# EAGLE design rev1 (EAGLE 6.2)
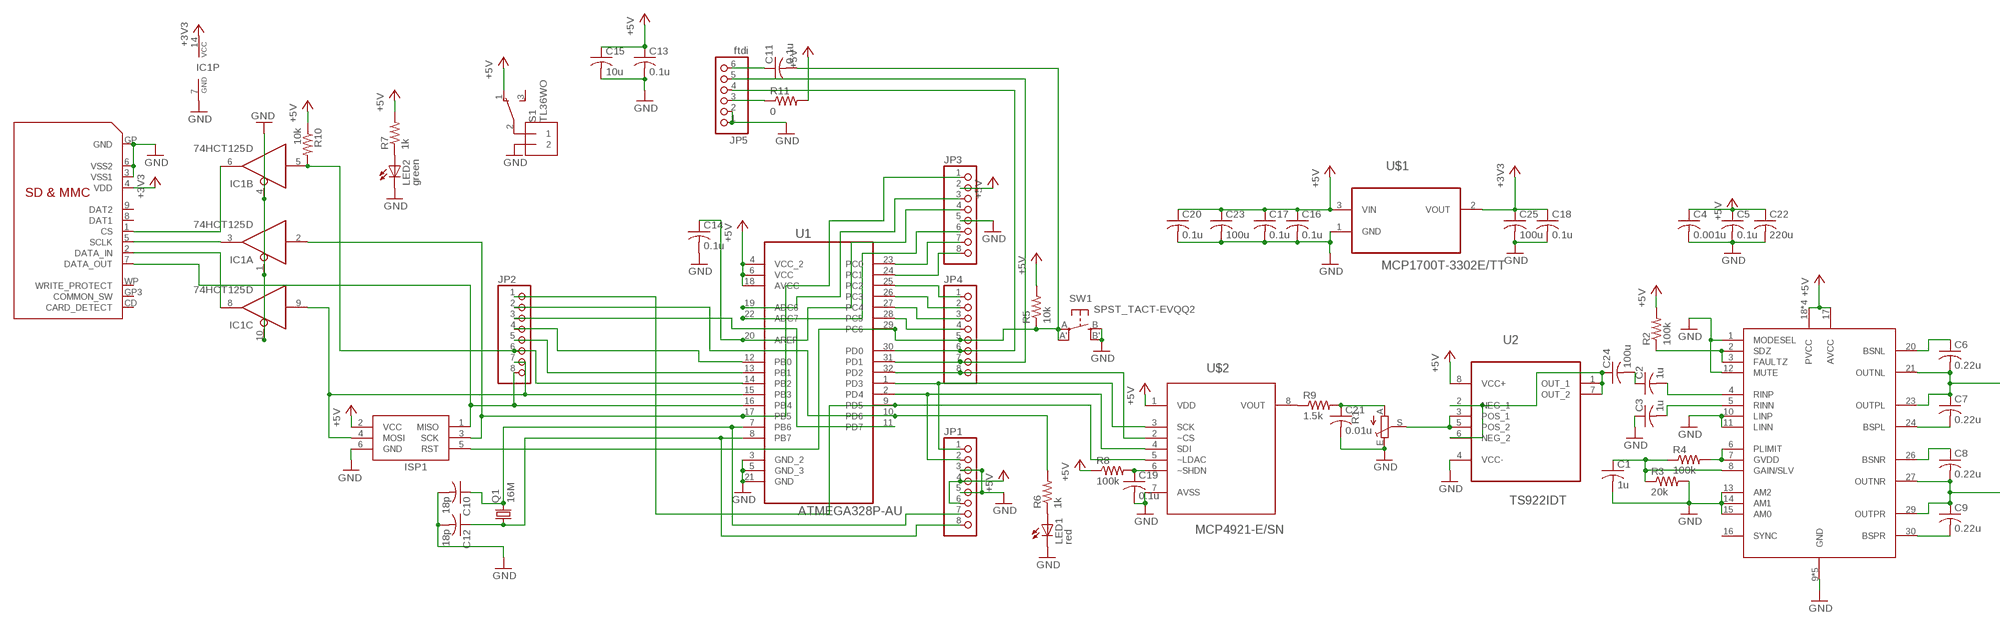
[diagram p0: schematic, sheet 1, part 1 of 2]
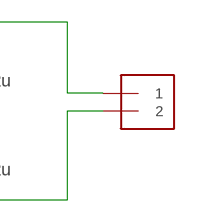
[diagram p1: schematic, sheet 1, part 2 of 2]

## Parts
C1  1u  C-USC0603  [C0603]
C2  1u  C-USC0603  [C0603]
C3  1u  C-USC0603  [C0603]
C4  0.001u  C-USC0603  [C0603]
C5  0.1u  C-USC0603  [C0603]
C6  0.22u  C-USC0603  [C0603]
C7  0.22u  C-USC0603  [C0603]
C8  0.22u  C-USC0603  [C0603]
C9  0.22u  C-USC0603  [C0603]
C10  18p  C-USC0603  [C0603]
C11  0.1u  C-USC0603  [C0603]
C12  18p  C-USC0603  [C0603]
C13  0.1u  C-USC0603  [C0603]
C14  0.1u  C-USC0603  [C0603]
C15  10u  C-US025-050X050  [C025-050X050]
C16  0.1u  C-USC0603  [C0603]
C17  0.1u  C-USC0603  [C0603]
C18  0.1u  C-USC0603  [C0603]
C19  0.1u  C-USC0603  [C0603]
C20  0.1u  C-USC0603  [C0603]
C21  0.01u  C-USC0603  [C0603]
C22  220u  C-US025-060X050  [C025-060X050]
C23  100u  C-US025-050X050  [C025-050X050]
C24  100u  C-US025-050X050  [C025-050X050]
C25  100u  C-US025-050X050  [C025-050X050]
IC1  74HCT125D  [SO14]
ISP1  AVRISP-6  [AVRISP]
J1  POWER  1X2-3.5MM  [1X2-3.5MM]
J2  Speaker  1X2-3.5MM  [1X2-3.5MM]
JP1  PINHD-1X8BIG  [1X08-BIG]
JP2  PINHD-1X8BIG  [1X08-BIG]
JP3  PINHD-1X8BIG  [1X08-BIG]
JP4  PINHD-1X8BIG  [1X08-BIG]
JP5  ftdi  PINHD-1X6  [1X06]
LED1  red  LED3MM  [LED3MM]
LED2  green  LED3MM  [LED3MM]
Q1  16M  CRYSTALHC49UP  [HC49UP]
R1  TRIM_EU-CA9V  [CA9V]
R2  100k  R-US_R0603  [R0603]
R3  20k  R-US_R0603  [R0603]
R4  100k  R-US_R0603  [R0603]
R5  10k  R-US_R0603  [R0603]
R6  1k  R-US_R0603  [R0603]
R7  1k  R-US_R0603  [R0603]
R8  100k  R-US_R0603  [R0603]
R9  1.5k  R-US_R0603  [R0603]
R10  10k  R-US_R0603  [R0603]
R11  0  R-US_R0603  [R0603]
S1  TL36WO  [TL3XWO]
SW1  SPST_TACT-EVQQ2  [EVQ-Q2]
U1  ATMEGA328P-AU  [QFP80P900X900X120-32N]
U2  TS922IDT  [SOIC127P600X175-8N]
U$1  MCP1700T-3302E/TT  [SOT95P237X112-3N]
U$2  MCP4921-E/SN  [SOIC8-N_MC]
U$3  SDMMC06132  [06132]
U$4  TPA3118D2DAP  [TPA3118D2DAP]

## Nets
+3V3: C18.1 C25.1 IC1.14(P:VCC) U$1.2(VOUT) U$3.4(VDD)
+5V: C4.1 C5.1 C13.1 C15.1 C16.1 C17.1 C20.1 C22.1 C23.1 ISP1.2(VCC) JP1.4 JP1.6 JP3.2 R2.2 R5.2 R7.2 R8.1 R10.1 R11.2 S1.1(O) U1.4(VCC_2) U1.6(VCC) U1.18(AVCC) U2.8(VCC+) U$1.3(VIN) U$2.1(VDD) U$4.17(AVCC) U$4.18(PVCC) U$4.19(PVCC) U$4.31(PVCC) U$4.32(PVCC)
GND: C1.2 C3.1 C4.2 C5.2 C10.2 C12.2 C13.2 C14.2 C15.2 C16.2 C17.2 C18.2 C19.2 C20.2 C21.2 C22.2 C23.2 C25.2 IC1.1(A:OE) IC1.4(B:OE) IC1.7(P:GND) IC1.10(C:OE) ISP1.6(GND) J1.2 JP1.3 JP1.5 JP3.5 JP5.1 JP5.2 LED1.K(C) LED2.K(C) R1.E R3.2 SW1.B'(S1) SW1.B(S) U1.3(GND_2) U1.5(GND_3) U1.21(GND) U2.4(VCC-) U$1.1(GND) U$2.7(AVSS) U$3.3(VSS1) U$3.6(VSS2) U$3.GP(GND) U$4.1(MODESEL) U$4.9(GND) U$4.10(LINP) U$4.11(LINN) U$4.12(MUTE) U$4.13(AM2) U$4.14(AM1) U$4.15(AM0) U$4.22(GND) U$4.25(GND) U$4.28(GND) U$4.33(GND)
N$1: C6.1 U$4.20(BSNL)
N$2: R2.1 U$4.2(SDZ) U$4.3(FAULTZ)
N$3: R4.2 U$4.6(PLIMIT) U$4.7(GVDD)
N$4: C1.1 R3.1 R4.1 U$4.8(GAIN/SLV)
N$5: C6.2 C7.1 J2.1 U$4.21(OUTNL) U$4.23(OUTPL)
N$6: C7.2 U$4.24(BSPL)
N$7: C8.1 U$4.26(BSNR)
N$8: C3.2 U$4.5(RINN)
N$9: C8.2 C9.1 J2.2 U$4.27(OUTNR) U$4.29(OUTPR)
N$10: C9.2 U$4.30(BSPR)
N$11: C2.2 U$4.4(RINP)
N$12: ISP1.1(MISO) JP2.8 U1.16(PB4) U$3.7(DATA_OUT)
N$13: C10.1 JP1.7 Q1.2 U1.7(PB6)
N$15: JP4.4 U1.28(PC5)
N$16: C11.1 JP5.6
N$17: JP5.3 R11.1
N$18: C12.1 JP1.8 Q1.1 U1.8(PB7)
N$19: LED1.A R6.1
N$20: C14.1 JP3.4 U1.20(AREF)
N$21: IC1.9(C:I) ISP1.4(MOSI) JP2.7 U1.15(PB3)
N$22: JP4.3 U1.27(PC4)
N$23: LED2.A R7.1
N$24: J1.1 S1.2(P)
N$25: JP4.7 JP5.5 U1.31(PD1)
N$26: JP4.6 JP5.4 U1.30(PD0)
N$27: C11.2 ISP1.5(RST) JP4.5 R5.1 SW1.A'(P1) SW1.A(P) U1.29(PC6)
N$28: JP4.2 U1.26(PC3)
N$29: JP4.1 U1.25(PC2)
N$30: JP4.8 U1.32(PD2) U$2.2(~CS)
N$31: JP3.8 U1.24(PC1)
N$32: JP3.7 U1.23(PC0)
N$33: JP3.6 U1.22(ADC7)
N$34: JP3.3 U1.19(ADC6)
N$35: C24.1 U2.1(OUT_1) U2.2(NEG_1) U2.6(NEG_2) U2.7(OUT_2)
N$36: IC1.5(B:I) JP2.6 R10.2 U1.14(PB2)
N$37: JP2.5 U1.13(PB1)
N$38: JP2.4 U1.12(PB0)
N$39: JP2.3 U1.11(PD7)
N$40: JP2.2 R6.2 U1.10(PD6)
N$41: JP2.1 U1.9(PD5) U$2.5(~LDAC)
N$42: R1.S U2.3(POS_1) U2.5(POS_2)
N$43: C21.1 R1.A R9.2
N$44: JP1.1 U1.1(PD3) U$2.3(SCK)
N$45: JP1.2 U1.2(PD4) U$2.4(SDI)
N$46: C2.1 C24.2
N$47: IC1.3(A:O) U$3.5(SCLK)
N$48: IC1.8(C:O) U$3.2(DATA_IN)
N$49: IC1.6(B:O) U$3.1(CS)
N$52: IC1.2(A:I) ISP1.3(SCK) JP3.1 U1.17(PB5)
N$54: C19.1 R8.2 U$2.6(~SHDN)
N$55: R9.1 U$2.8(VOUT)
Unconnected: IC1.11(D:O) IC1.12(D:I) IC1.13(D:OE) S1.3(S) U$3.8(DAT1) U$3.9(DAT2) U$3.CD(CARD_DETECT) U$3.GP3(COMMON_SW) U$3.WP(WRITE_PROTECT) U$4.16(SYNC)

## Library data of the parts
C1-C25 = resistor:C-US: CAPACITOR, American symbol
IC1 = 74xx-eu:74*125: Quad bus BUFFER, 3-state
ISP1 = adafruit:AVRISP: AVR ISP HEADER Standard 6 pin header for AVR programming
J1 J2 = adafruit:1X2: 3.5mm Terminal block http://www.ladyada.net/library/pcb/eaglelibrary.html
JP1-JP4 = adafruit:PINHD-1X8: PIN HEADER
JP5 = adafruit:PINHD-1X6: PIN HEADER
LED1 LED2 = adafruit:LED: LED OSRAM: - CHIPLED LG R971, LG N971, LY N971, LG Q971, LY Q971, LO R971, LY R971 LH N974, LH R974 LS Q976, LO Q976, LY Q976 LO Q996 - Hyper CHIPLED LW Q18S LB Q993, LB Q99A, LB R99A - SideLED LS A670, LO A670, LY A670, LG A670, LP A670 LB A673, LV A673, LT A673, LW A673 LH A674 LY A675 LS A676, LA A676, LO A676, LY A676, LW A676 LS A679, LY A679, LG A679 - Hyper Micro SIDELED® LS Y876, LA Y876, LO Y876, LY Y876 LT Y87S - SmartLED LW L88C, LW L88S LB L89C, LB L89S, LG L890 LS L89K, LO L89K, LY L89K LS L896, LA L896, LO L896, LY L896 - TOPLED LS T670, LO T670, LY T670, LG T670, LP T670 LSG T670, LSP T670, LSY T670, LOP T670, LYG T670 LG T671, LOG T671, LSG T671 LB T673, LV T673, LT T673, LW T673 LH T674 LS T676, LA T676, LO T676, LY T676, LB T676, LH T676, LSB T676, LW T676 LB T67C, LV T67C, LT T67C, LS T67K, LO T67K, LY T67K, LW E67C LS E67B, LA E67B, LO E67B, LY E67B, LB E67C, LV E67C, LT E67C LW T67C LS T679, LY T679, LG T679 LS T770, LO T770, LY T770, LG T770, LP T770 LB T773, LV T773, LT T773, LW T773 LH T774 LS E675, LA E675, LY E675, LS T675 LS T776, LA T776, LO T776, LY T776, LB T776 LHGB T686 LT T68C, LB T68C - Hyper Mini TOPLED® LB M676 - Mini TOPLED Santana® LG M470 LS M47K, LO M47K, LY M47K Source: http://www.osram.convergy.de/
Q1 = adafruit:CRYSTAL: CRYSTAL; OC_FARNELL: unknown; OC_NEWARK: unknown
R1 = pot:TRIM_EU-: POTENTIOMETER
R2-R11 = resistor:R-US_: RESISTOR, American symbol
S1 = switch:TL36WO: TINY SWITCH ON - ON Source: http://www2.produktinfo.conrad.com/datenblaetter/700000-724999/705152-da-01-de-Subminiaturschalter_TL_36WO.pdf
SW1 = adafruit:SPST_TACT: SMT 6mm switch, EVQQ2 series http://www.ladyada.net/library/eagle
U1 = Atmel_By_element14_Batch_1:ATMEGA328P-AU: 8-bit Microcontroller with In-System Programmable Flash; MPN: ATMEGA328P-AU; OC_FARNELL: 1715486; OC_NEWARK: 14R4631; PACKAGE: TQFP-32; SUPPLIER: Atmel
U2 = ST Microelctronics_By_element14_Batch_1:TS922IDT: operational amplifiers; MPN: TS922IDT; OC_FARNELL: 1642724; OC_NEWARK: 08P4888; PACKAGE: SOIC-8; SUPPLIER: STMICROELECTRONICS
U$1 = Microchip_By_element14_Batch_1:MCP1700T-3302E/TT: Low Quiescent Current LDO; MPN: MCP1700T-3302E/TT; OC_FARNELL: 1296592; OC_NEWARK: 88H9817; PACKAGE: SOT23-3; SUPPLIER: Microchip
U$2 = Microchip_By_element14_Batch_1:MCP4921-E/SN: 12 Bit DAC; DESCRIPTION: 12 Bit DAC; MPN: MCP4921-E/SN; OC_FARNELL: 1332113; OC_NEWARK: 08J8744; PACKAGE: SOIC-8; SUPPLIER: Microchip
U$3 = adafruit:SDMMC: SD MMC Card holder 4UCON part #06132 - easy to solder
U$4 = Texas Instruments_By_element14_Batch_1:TPA3118D2DAP

## Board
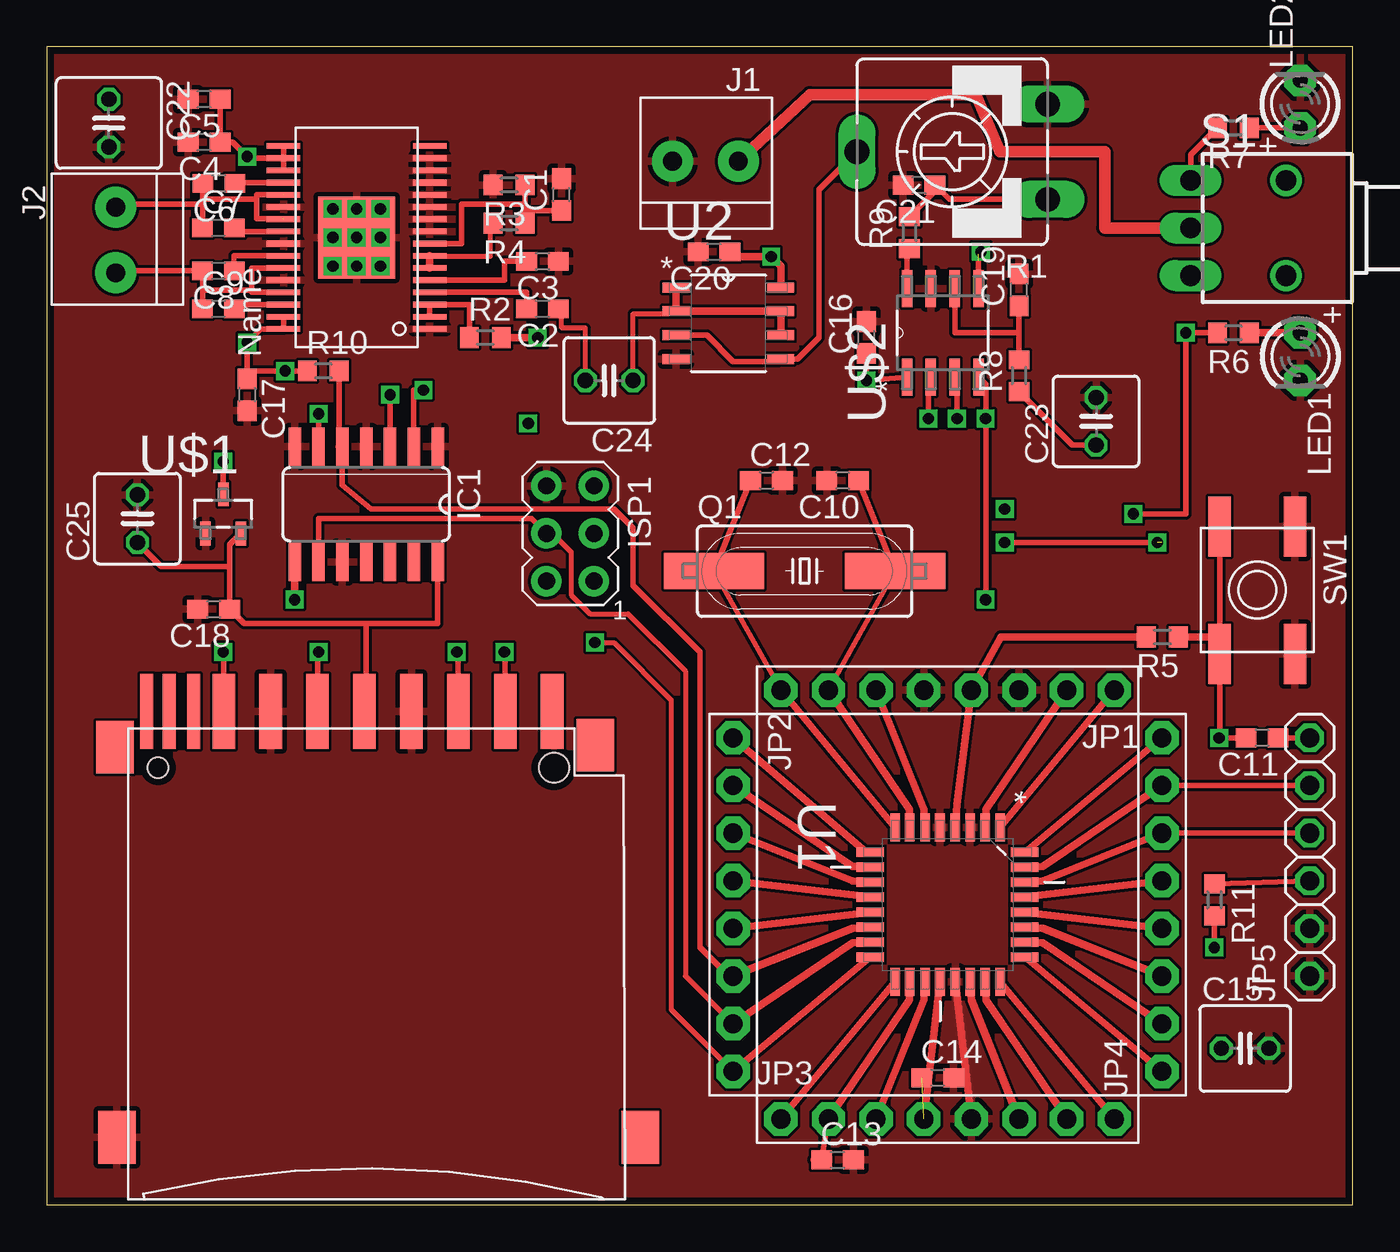
[diagram p2: board, top side]
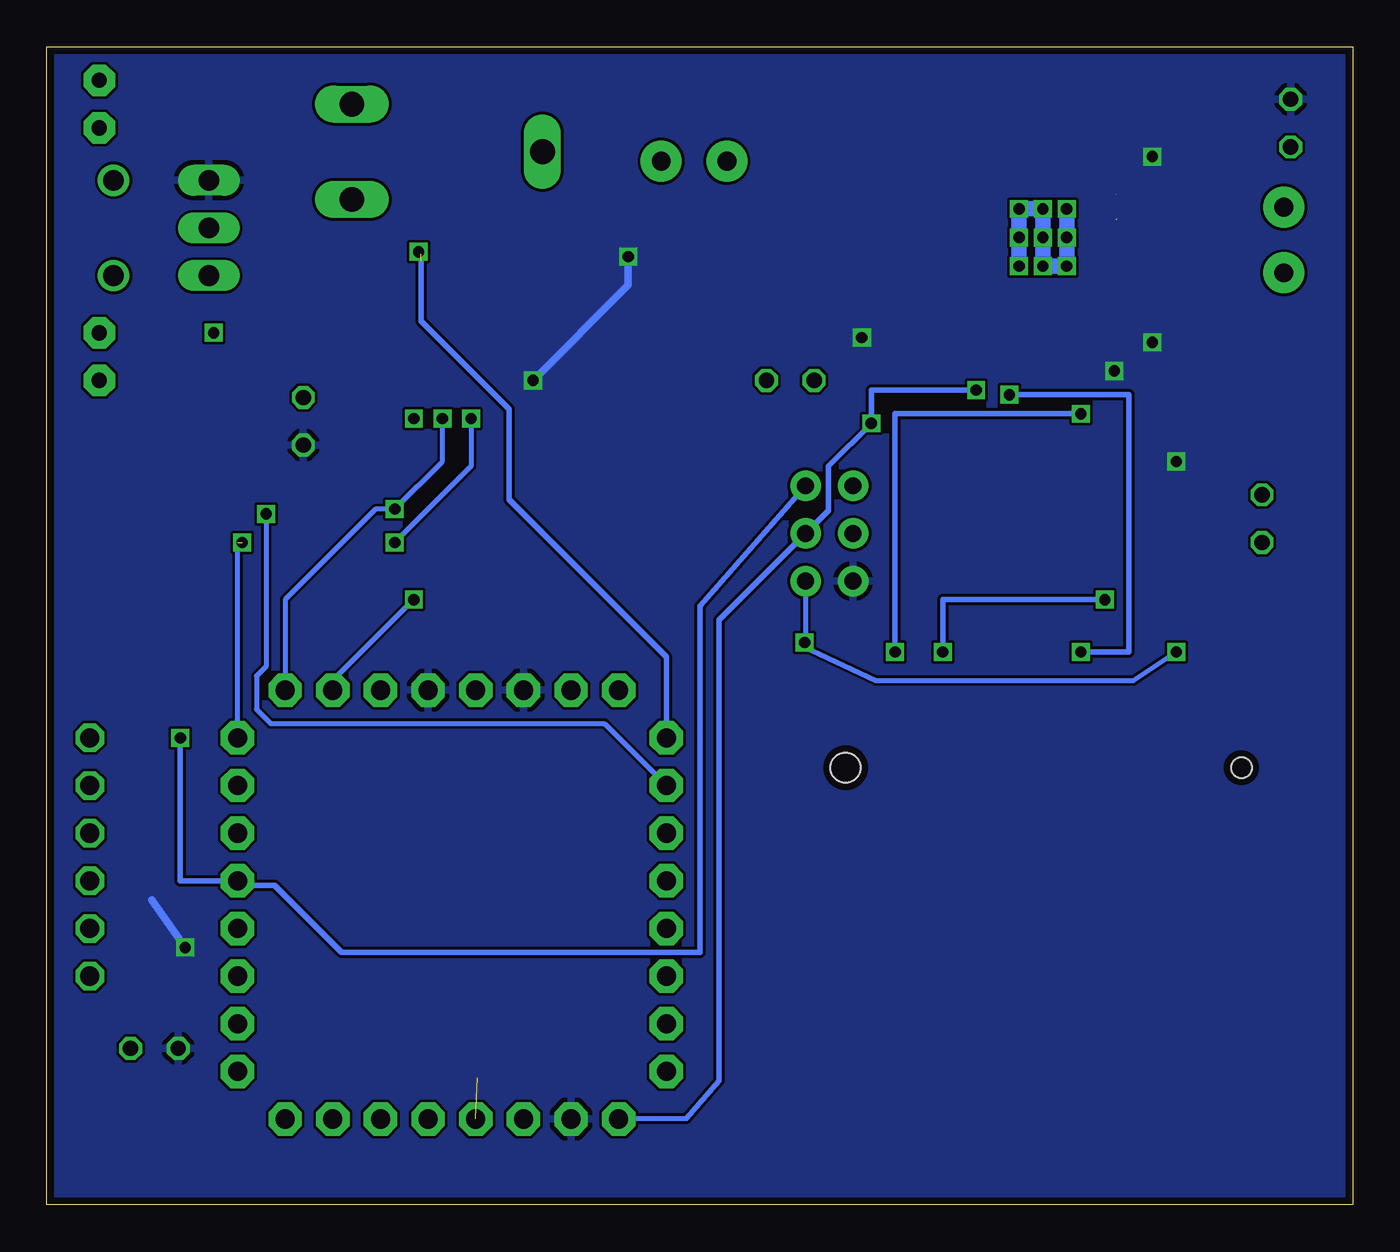
[diagram p3: board, bottom side, seen from below]

Size 69.6 x 61.72 mm. Coordinates in mm from the lower left corner, seen from the top.
Outline: 0,0 69.6,0 69.6,61.72 0,61.72 0,0
Copper layers (1*16): Top 0.0356mm / dielectric 1.5011mm / Bottom 0.0356mm
Design rules: minimum track width 6mil, minimum drill 13mil, track to track 6mil, track to pad 6mil, pad to pad 6mil, via to via 6mil, smd to smd 6mil, copper to edge 15mil, drill to drill 6mil, minimum pad ring 7mil, minimum via ring 7mil, stop-mask expansion 3mil, vias tented up to drill 0mil, thermal gap 10mil

### Footprints (pad centres in the part's own frame; a part is rotated, then mirrored left to right if it is on the bottom)
C0603 = smd 1.1 x 1: 1 -0.85,0; 2 0.85,0
C025-050X050 = drill 0.813 octagon: 1 -1.27,0; 2 1.27,0
C025-060X050 = drill 0.813 octagon: 1 -1.27,0; 2 1.27,0
SO14 = smd 0.66 x 2.032: 1 -3.81,-3.073; 2 -2.54,-3.073; 3 -1.27,-3.073; 4 0,-3.073; 5 1.27,-3.073; 6 2.54,-3.073; 7 3.81,-3.073; 8 3.81,3.073; 9 2.54,3.073; 10 1.27,3.073; 11 0,3.073; 12 -1.27,3.073; 13 -2.54,3.073; 14 -3.81,3.073
AVRISP = drill 0.9 pad 1.626: 1 -1.27,2.54; 2 1.27,2.54; 3 -1.27,0; 4 1.27,0; 5 -1.27,-2.54; 6 1.27,-2.54
1X2-3.5MM = drill 1 pad 2.184: 1 1.8,0; 2 -1.7,0
1X08-BIG = drill 1.016 pad 1.778 octagon: 1 -8.89,0; 2 -6.35,0; 3 -3.81,0; 4 -1.27,0; 5 1.27,0; 6 3.81,0; 7 6.35,0; 8 8.89,0
1X06 = drill 1.016 octagon: 1 -6.35,0; 2 -3.81,0; 3 -1.27,0; 4 1.27,0; 5 3.81,0; 6 6.35,0
LED3MM = drill 0.813 pad 1.676 octagon: A -1.27,0; K 1.27,0
HC49UP = smd 5.334 x 1.93: 1 -4.826,0; 2 4.826,0
CA9V = drill 1.321 long: A -2.54,-5.08; E 2.54,-5.08; S 0,5.08
R0603 = smd 1 x 1.1: 1 -0.85,0; 2 0.85,0
TL3XWO = drill 1.1 pad 1.422 long: 1 -2.54,-5.08; 2 0,-5.08; 3 2.54,-5.08 | drill 1.1 pad 1.676: M1 -2.54,0; M2 2.54,0
EVQ-Q2 = smd 3.2 x 1.2: A -3.4,-2; A' 3.4,-2; B -3.4,2; B' 3.4,2
QFP80P900X900X120-32N = smd 1.473 x 0.508: 1 -4.115,2.794; 2 -4.115,2.007; 3 -4.115,1.194; 4 -4.115,0.406; 5 -4.115,-0.406; 6 -4.115,-1.194; 7 -4.115,-2.007; 8 -4.115,-2.794; 17 4.115,-2.794; 18 4.115,-2.007; 19 4.115,-1.194; 20 4.115,-0.406; 21 4.115,0.406; 22 4.115,1.194; 23 4.115,2.007; 24 4.115,2.794 | smd 0.508 x 1.473: 9 -2.794,-4.115; 10 -2.007,-4.115; 11 -1.194,-4.115; 12 -0.406,-4.115; 13 0.406,-4.115; 14 1.194,-4.115; 15 2.007,-4.115; 16 2.794,-4.115; 25 2.794,4.115; 26 2.007,4.115; 27 1.194,4.115; 28 0.406,4.115; 29 -0.406,4.115; 30 -1.194,4.115; 31 -2.007,4.115; 32 -2.794,4.115
SOIC127P600X175-8N = smd 1.422 x 0.533: 1 -2.794,1.905; 2 -2.794,0.635; 3 -2.794,-0.635; 4 -2.794,-1.905; 5 2.794,-1.905; 6 2.794,-0.635; 7 2.794,0.635; 8 2.794,1.905
SOT95P237X112-3N = smd 0.559 x 1.27: 1 -0.94,-1.041; 2 0.94,-1.041; 3 0,1.041
SOIC8-N_MC = smd 1.981 x 0.559: 1 -2.362,1.905; 2 -2.362,0.635; 3 -2.362,-0.635; 4 -2.362,-1.905; 5 2.362,-1.905; 6 2.362,-0.635; 7 2.362,0.635; 8 2.362,1.905
06132 = smd 1.2 x 4: 1 6.9,0.9; 2 4.4,0.9; 3 1.9,0.9; 4 -0.6,0.9; 5 -3.1,0.9; 6 -5.6,0.9; 7 -8.1,0.9; 9 9.4,0.9 | smd 0.7 x 4: 8 -9.7,0.9; CD -11,0.9; WP -12.2,0.9 | smd 2 x 2.8: GP -13.8,-21.8; GP2 14.1,-21.8; GP3 11.7,-0.9; GP4 -13.9,-1 | hole 1.1: -11.6,-2.1 | hole 1.6: 9.5,-2.1
TPA3118D2DAP = smd 0.3 x 1.8: 1 -4.875,-3.9; 2 -4.225,-3.9; 3 -3.575,-3.9; 4 -2.925,-3.9; 5 -2.275,-3.9; 6 -1.625,-3.9; 7 -0.975,-3.9; 8 -0.325,-3.9; 9 0.325,-3.9; 10 0.975,-3.9; 11 1.625,-3.9; 12 2.275,-3.9; 13 2.925,-3.9; 14 3.575,-3.9; 15 4.225,-3.9; 16 4.875,-3.9; 17 4.875,3.9; 18 4.225,3.9; 19 3.575,3.9; 20 2.925,3.9; 21 2.275,3.9; 22 1.625,3.9; 23 0.975,3.9; 24 0.325,3.9; 25 -0.325,3.9; 26 -0.975,3.9; 27 -1.625,3.9; 28 -2.275,3.9; 29 -2.925,3.9; 30 -3.575,3.9; 31 -4.225,3.9; 32 -4.875,3.9 | smd 4.36 x 4.11: 33 0,0

### Placement (x,y rotation side)
C1  27.43,53.85 90 top
C2  26.42,47.75 180 top
C3  26.42,50.29 180 top
C4  8.38,56.64 180 top
C5  8.38,58.93 180 top
C6  9.16,54.44 180 top
C7  9.14,52.07 0 top
C8  9.14,49.78 180 top
C9  9.14,47.75 0 top
C10  42.42,38.61 180 top
C11  64.77,24.89 180 top
C12  38.35,38.61 0 top
C13  42.14,2.39 0 top
C14  47.48,6.78 0 top
C15  63.87,8.34 0 top
C16  43.69,46.23 90 top
C17  10.67,43.18 270 top
C18  8.89,31.75 180 top
C19  51.82,48.77 90 top
C20  35.56,50.8 180 top
C21  46.48,54.36 180 top
C22  3.3,57.66 270 top
C23  55.93,41.76 90 top
C24  29.97,43.94 180 top
C25  4.83,36.58 90 top
IC1  17.02,37.34 180 top
ISP1  27.89,35.78 180 top
J1  35.05,55.63 0 top
J2  3.66,51.38 90 top
JP1  48.01,27.43 180 top
JP2  36.58,16 270 top
JP3  48.01,4.57 0 top
JP4  59.44,16 90 top
JP5  67.31,18.54 90 top
LED1  66.8,45.21 270 top
LED2  66.8,58.67 90 top
Q1  40.39,33.78 0 top
R1  48.26,56.13 90 top
R2  23.37,46.23 0 top
R3  24.64,54.36 180 top
R4  24.64,52.32 180 top
R5  59.46,30.27 180 top
R6  63.25,46.48 180 top
R7  63.25,57.4 180 top
R8  51.82,44.2 90 top
R9  45.97,51.82 90 top
R10  14.73,44.45 0 top
R11  62.23,16.26 270 top
S1  66.04,52.07 270 top
SW1  64.52,32.77 270 top
U1  48.01,16 270 top
U2  36.32,46.99 0 top
U$1  9.4,36.83 0 top
U$2  47.75,46.48 90 top
U$3  17.53,25.4 0 top
U$4  16.51,51.56 90 top

### Tracks (layer width: path | path; a pad name or v marks a point on that pad's centre or on a via)
+3V3
  Top 0.305: 17.02,27.57 17.02,30.99 | 17.02,30.99 20.83,30.99 IC1.14 | 17.02,30.99 10.5,30.99 C18.1 9.74,34.04 | 9.74,34.04 9.74,35.19 U$1.2 | C25.1 6.1,34.04 9.74,34.04
  Top 0.406: U$3.4 17.02,27.57
+5V  (via drill 0.6)
  Top 0.305: 10.67,44.45 v12.7,44.45 R10.1 | v9.4,39.62 U$1.3 | U$2.1 v43.69,43.94 C16.1 | R11.2 v62.23,13.72 | C17.1 v10.67,45.97 11.38,46.69 U$4.32 U$4.31 | S1.1 60.96,55.97 R7.2 | R8.1 54.67,40.49 C23.1 | JP3.2 C13.1 | U$4.18 U$4.19 | U$4.17 U$4.18 | U$4.18 10.76,55.79 v10.67,55.88 9.91,56.64 C4.1 C5.1
  Top 0.406: C17.1 10.67,44.45 | 40.89,2.39 C13.1 | U1.18 45.97,10.92 JP3.2 | U1.6 46.74,21.08 JP1.6 | v26.16,46.23 R2.2 | U2.8 39.12,50.04 v38.61,50.55 36.66,50.55 C20.1 | R5.2 50.84,30.27 JP1.4 48.51,21.34 U1.4
  Bottom 0.254: v10.67,55.88 10.41,55.88
  Bottom 0.406: v62.23,13.72 64.01,16.26 | v38.61,50.55 38.61,49.02 v43.69,43.94
  pour Bottom: 0.25,61.47 69.34,61.47 69.34,0.25 0.25,0.25
GND  (via drill 0.6)
  Top 0.406: U1.21 JP3.5
  Bottom 0.813: v15.24,53.09 v15.24,51.56 v15.24,50.04 v16.51,50.04 U$4.33 v16.51,53.09 v17.78,53.09 v17.78,50.04
  other vias: 17.78,51.56 16.51,51.56
  pour Top: 69.34,61.47 69.34,0.25 0.25,0.25 0.25,61.47
N$1
  Top 0.305: U$4.20 10.01,54.49 C6.1
N$2
  Top 0.305: U$4.2 U$4.3 22.54,47.99 R2.1
N$3
  Top 0.254: R4.2 23.62,52.32 23.62,50.55 20.41,50.55
  Top 0.406: U$4.7 20.41,50.55 U$4.6
N$4
  Top 0.254: R4.1 25.49,53
  Top 0.305: 25.49,53.34 22.1,53.34 22.1,51.31 22.1,51.24 U$4.8 | 25.49,53.34 R3.1 | C1.1 25.49,53 25.49,53.34
N$5  (2 unrouted)
  Top 0.254: C6.2 8.29,54.42 | J2.1 3.83,53.34
  Top 0.305: 8.29,54.42 8.29,53.59 | 8.29,53.59 8.29,53.34 | 8.29,53.34 C7.1 | 3.83,53.34 8.29,53.34 | 12.57,52.58 11.18,52.58 11.18,53.59 | U$4.21 11.18,53.85 11.18,53.59 | 11.18,53.59 8.29,53.59
N$6
  Top 0.305: U$4.24 9.99,51.89 C7.2
N$7
  Top 0.254: C8.1 9.99,50.59
  Top 0.305: 9.99,50.59 U$4.26
N$8
  Top 0.305: C3.2 24.38,50.29 24.38,49.29 U$4.5
N$9
  Top 0.254: 3.66,49.78 J2.2 | 10.92,48.77 10.92,48.64
  Top 0.305: C8.2 3.66,49.78 | C9.1 C8.2 | C8.2 8.29,48.77 10.92,48.77 10.92,49.94 U$4.27 | U$4.29 10.92,48.64
N$10
  Top 0.305: U$4.30 9.99,47.99 C9.2
N$11
  Top 0.305: U$4.4 25.57,48.64 C2.2
N$12  (via drill 0.6)
  Top 0.254: v29.21,29.97 30.23,29.97 33.27,26.92 33.27,10.41 JP2.8
  Top 0.305: U$3.7 9.43,29.46
  Top 0.406: U1.16 JP2.8 | 9.43,29.46 v9.4,29.46
  Bottom 0.254: v9.4,29.46 11.68,27.94 25.4,27.94 29.26,29.77 29.16,30.02 | ISP1.1 29.16,30.02 | 29.16,30.02 v29.21,29.97
N$13
  Top 0.305: C10.1 Q1.2 JP1.7
  Top 0.406: U1.7 45.97,21.08 JP1.7
N$15
  Top 0.406: JP4.4 U1.28
N$16
  Top 0.305: JP5.6 C11.1
N$17
  Top 0.305: JP5.3 R11.1
N$18
  Top 0.305: C12.1 Q1.1 JP1.8
  Top 0.406: 45.21,20.07 U1.8 JP1.8
N$19
  Top 0.406: LED1.A R6.1
N$20  (1 unrouted)
  Top 0.406: U1.20 JP3.4
N$21
  Top 0.254: JP2.7 34.04,12.19 34.04,28.45 30.99,31.5 28.96,31.5 27.94,32.51 27.94,34.8 26.95,35.78 ISP1.4 25.83,36.58
  Top 0.305: IC1.9 14.48,36.58 25.83,36.58
  Top 0.406: U1.15 42.93,13.97 JP2.7
N$22
  Top 0.406: JP4.3 53.09,14.73 U1.27
N$23
  Top 0.305: LED2.A R7.1
N$24
  Top 0.61: J1.1 40.66,59.18 49.53,59.18 50.8,56.13 56.39,56.13 56.39,52.07 S1.2
N$25
  Top 0.305: JP5.5 JP4.7
  Top 0.406: U1.31 53.09,18.03 JP4.7
N$26
  Top 0.305: JP5.4 JP4.6
  Top 0.406: JP4.6 53.09,17.27 U1.30
N$27  (via drill 0.6)
  Top 0.305: C11.2 v62.48,24.89 62.52,24.89 SW1.A' SW1.A
  Top 0.406: JP4.5 U1.29 | SW1.A' 62.52,30.27 R5.1
  Bottom 0.305: v62.48,24.89 62.48,17.27 JP4.5 | 58.76,17.04 57.46,17.04 53.88,13.46 34.8,13.46 34.8,31.93 ISP1.5 | 58.93,17.21 59.38,17.21
  Bottom 0.406: 58.76,17.04 58.93,17.21 | 59.38,17.21 JP4.5
N$28
  Top 0.406: U1.26 53.09,13.97 JP4.2
N$29
  Top 0.406: JP4.1 U1.25
N$30  (via drill 0.6)  (1 unrouted)
  Top 0.254: 46.99,43.99 U$2.2
  Top 0.305: v46.99,41.91 46.99,43.99 | v51.05,35.31 v59.18,35.31
  Top 0.406: JP4.8 U1.32
  Bottom 0.254: v46.99,41.91 46.99,39.37 v51.05,35.31 | JP4.8 59.44,35.31
N$31
  Top 0.406: U1.24 JP3.8
N$32
  Top 0.406: U1.23 50.04,10.92 JP3.7
N$33
  Top 0.406: JP3.6 49.28,10.92 U1.22
N$34
  Top 0.406: U1.19 46.74,10.92 JP3.3
N$35
  Top 0.254: C24.1 31.24,47.5 33.4,47.5 U2.2
  Top 0.406: U2.6 U2.7 U2.2 U2.1
N$36
  Top 0.254: JP2.6 36.32,12.19
  Top 0.305: 15.58,40.41 R10.2 | IC1.5 15.75,38.35 17.27,37.08 30.23,37.08 31.24,36.07 31.24,33.02 34.8,29.46 34.8,13.72 36.32,12.19
  Top 0.406: U1.14 42.93,14.73 JP2.6 | IC1.5 15.58,40.41
N$37
  Top 0.406: U1.13 JP2.5
N$38
  Top 0.406: U1.12 JP2.4
N$39
  Top 0.406: U1.11 42.93,17.27 JP2.3
N$40  (via drill 0.6)
  Top 0.305: R6.2 v60.71,46.48 60.71,36.83 v57.91,36.83
  Top 0.406: U1.10 43.94,18.03 42.93,18.03 JP2.2
  Bottom 0.254: v57.91,36.83 57.91,28.7 58.42,28.19 58.42,26.42 57.66,25.65 39.88,25.65 JP2.2
N$41  (via drill 0.6)  (1 unrouted)
  Top 0.305: U$2.5 49.66,50.67 v49.78,50.8
  Top 0.406: U1.9 43.69,18.8 JP2.1
  Bottom 0.305: JP2.1 36.58,29.21 44.96,37.59 44.96,42.42 49.66,47.12 49.66,50.29
N$42
  Top 0.254: 38.99,44.96 U2.5
  Top 0.305: U2.3 35.18,46.35 36.58,44.96 38.99,44.96 | U2.5 40,45.09 41.15,46.23 41.15,54.1 R1.S
N$43
  Top 0.305: R1.A 48.09,53.59 C21.1 47.33,54.02 R9.2
N$44  (via drill 0.6)
  Top 0.254: 48.51,43.99 U$2.3
  Top 0.305: v48.51,41.91 48.51,43.99
  Top 0.406: JP1.1 U1.1
  Bottom 0.254: v48.51,41.91 48.51,39.62 v51.05,37.08 52.07,37.08 56.9,32.26 JP1.1
N$45  (via drill 0.6)
  Top 0.254: 50.04,43.74 U$2.4
  Top 0.305: 50.04,43.74 v50.04,41.91 v50.04,32.26
  Top 0.406: U1.2 50.04,21.08 JP1.2
  Bottom 0.254: JP1.2 54.36,27.94 v50.04,32.26
N$46
  Top 0.254: C24.2 28.7,46.74 27.43,46.74 27.43,47.59 C2.1
N$47  (via drill 0.6)
  Top 0.305: U$3.5 14.43,29.46 | IC1.3 v18.29,43.18
  Top 0.406: 14.43,29.46 v14.48,29.46
  Bottom 0.305: v14.48,29.46 11.94,29.46 11.94,43.18 v18.29,43.18
N$48  (via drill 0.6)
  Top 0.305: U$3.2 21.93,29.46
  Top 0.406: 21.93,29.46 v21.84,29.46 | IC1.8 v13.21,32.26
  Bottom 0.305: v13.21,32.26 21.84,32.26 v21.84,29.46
N$49  (via drill 0.6)
  Top 0.305: U$3.1 24.43,29.46 | IC1.6 v14.48,42.16
  Top 0.406: 24.43,29.46 v24.38,29.46
  Bottom 0.305: v14.48,42.16 24.38,42.16 v24.38,29.46
N$52  (via drill 0.6)
  Top 0.305: IC1.2 19.56,43.43 v20.07,43.43
  Top 0.406: U1.17 JP3.1
  Bottom 0.254: v25.65,41.66 27.94,39.37
  Bottom 0.305: JP3.1 35.51,4.62 33.78,6.6 33.78,12.88 33.78,31.16 ISP1.3 27.94,37.01 27.94,39.37 | v20.07,43.43 25.65,43.43 v25.65,41.66
N$54
  Top 0.305: R8.2 51.82,46.48 | 51.82,46.48 C19.1 | U$2.6 48.39,46.48 51.82,46.48
N$55
  Top 0.254: 45.85,50.97 R9.1
  Top 0.305: U$2.8 45.85,50.97